# EAGLE design Teensy_FrequencyShield_2ch (EAGLE 6.5.0)
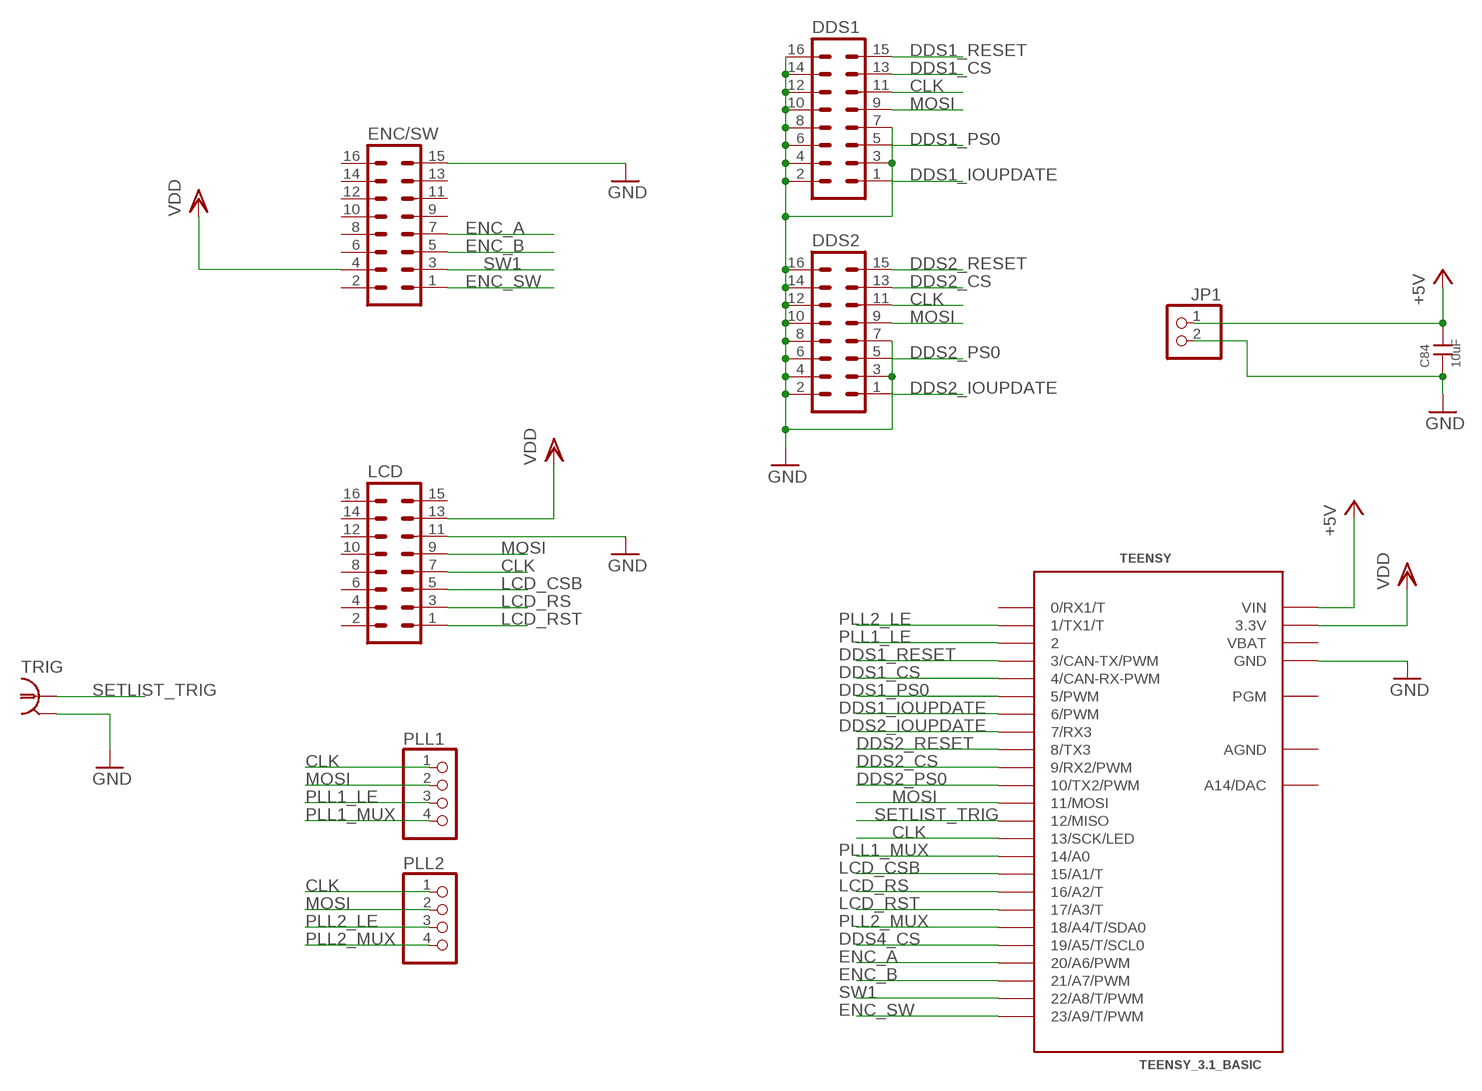
[diagram p0: schematic, sheet 1]

## Parts
C84  10uF  CAP0805  [0805]
DDS1  ML16  [ML16]
DDS2  ML16  [ML16]
ENC/SW  ML16  [ML16]
JP1  PINHD-1X2  [1X02]
LCD  ML16  [ML16]
PLL1  PINHD-1X4  [1X04]
PLL2  PINHD-1X4  [1X04]
TEENSY  TEENSY_3.1_BASIC  [TEENSY_3.1_BASIC]
TRIG  BNC-H  [BNC90]

## Nets
+5V: C84.2 JP1.1 TEENSY.VIN
CLK: DDS1.11 DDS2.11 LCD.7 PLL1.1 PLL2.1 TEENSY.13(13/SCK/LED)
DDS1_CS: DDS1.13 TEENSY.4(4/CAN-RX-PWM)
DDS1_IOUPDATE: DDS1.1 TEENSY.6(6/PWM)
DDS1_PS0: DDS1.5 TEENSY.5(5/PWM)
DDS1_RESET: DDS1.15 TEENSY.3(3/CAN-TX/PWM)
DDS2_CS: DDS2.13 TEENSY.9(9/RX2/PWM)
DDS2_IOUPDATE: DDS2.1 TEENSY.7(7/RX3)
DDS2_PS0: DDS2.5 TEENSY.10(10/TX2/PWM)
DDS2_RESET: DDS2.15 TEENSY.8(8/TX3)
DDS4_CS: TEENSY.19/A5(19/A5/T/SCL0)
ENC_A: ENC/SW.7 TEENSY.20/A6(20/A6/PWM)
ENC_B: ENC/SW.5 TEENSY.21/A7(21/A7/PWM)
ENC_SW: ENC/SW.1 TEENSY.23/A9(23/A9/T/PWM)
GND: C84.1 DDS1.2 DDS1.3 DDS1.4 DDS1.6 DDS1.7 DDS1.8 DDS1.10 DDS1.12 DDS1.14 DDS1.16 DDS2.2 DDS2.3 DDS2.4 DDS2.6 DDS2.7 DDS2.8 DDS2.10 DDS2.12 DDS2.14 DDS2.16 ENC/SW.15 JP1.2 LCD.11 TEENSY.GND TEENSY.GND1(GND) TRIG.2
LCD_CSB: LCD.5 TEENSY.15/A1(15/A1/T)
LCD_RS: LCD.3 TEENSY.16/A2(16/A2/T)
LCD_RST: LCD.1 TEENSY.17/A3(17/A3/T)
MOSI: DDS1.9 DDS2.9 LCD.9 PLL1.2 PLL2.2 TEENSY.11(11/MOSI)
PLL1_LE: PLL1.3 TEENSY.2
PLL1_MUX: PLL1.4 TEENSY.14/A0
PLL2_LE: PLL2.3 TEENSY.1(1/TX1/T)
PLL2_MUX: PLL2.4 TEENSY.18/A4(18/A4/T/SDA0)
SETLIST_TRIG: TEENSY.12(12/MISO) TRIG.1
SW1: ENC/SW.3 TEENSY.22/A8(22/A8/T/PWM)
VDD: ENC/SW.4 LCD.13 TEENSY.3.3V TEENSY.3.3V1(3.3V)
Unconnected: ENC/SW.2 ENC/SW.6 ENC/SW.8 ENC/SW.9 ENC/SW.10 ENC/SW.11 ENC/SW.12 ENC/SW.13 ENC/SW.14 ENC/SW.16 LCD.2 LCD.4 LCD.6 LCD.8 LCD.10 LCD.12 LCD.14 LCD.15 LCD.16 TEENSY.0(0/RX1/T) TEENSY.A14(A14/DAC) TEENSY.PGM

## Power pins joined to a net without a drawn wire
AGND: TEENSY.AGND
VBAT: TEENSY.VBAT

## Library data of the parts
C84 = rlc-jqi:CAP: SMT Capacitor; PARTNO: 1276-2890-1-ND
DDS1 DDS2 ENC/SW = mcu-accessories:ML16: HARTING 2x8 (16 pin) ribbon connector.; OC_FARNELL: unknown; OC_NEWARK: unknown
JP1 = pinhead:PINHD-1X2: PIN HEADER
LCD = mcu-accessories:ML16: HARTING 2x8 (16 pin) ribbon connector.; OC_FARNELL: unknown; OC_NEWARK: unknown; PARTNO: S9171-ND
PLL1 PLL2 = pinhead:PINHD-1X4: PIN HEADER
TEENSY = mcu-accessories:TEENSY_3.1_BASIC: Footprint for Teensy 3.1 board using all pin connections on the outer perimeter
TRIG = connector-jqi:BNC: BNC Connector.; DIGIKEY: 12345

## Board
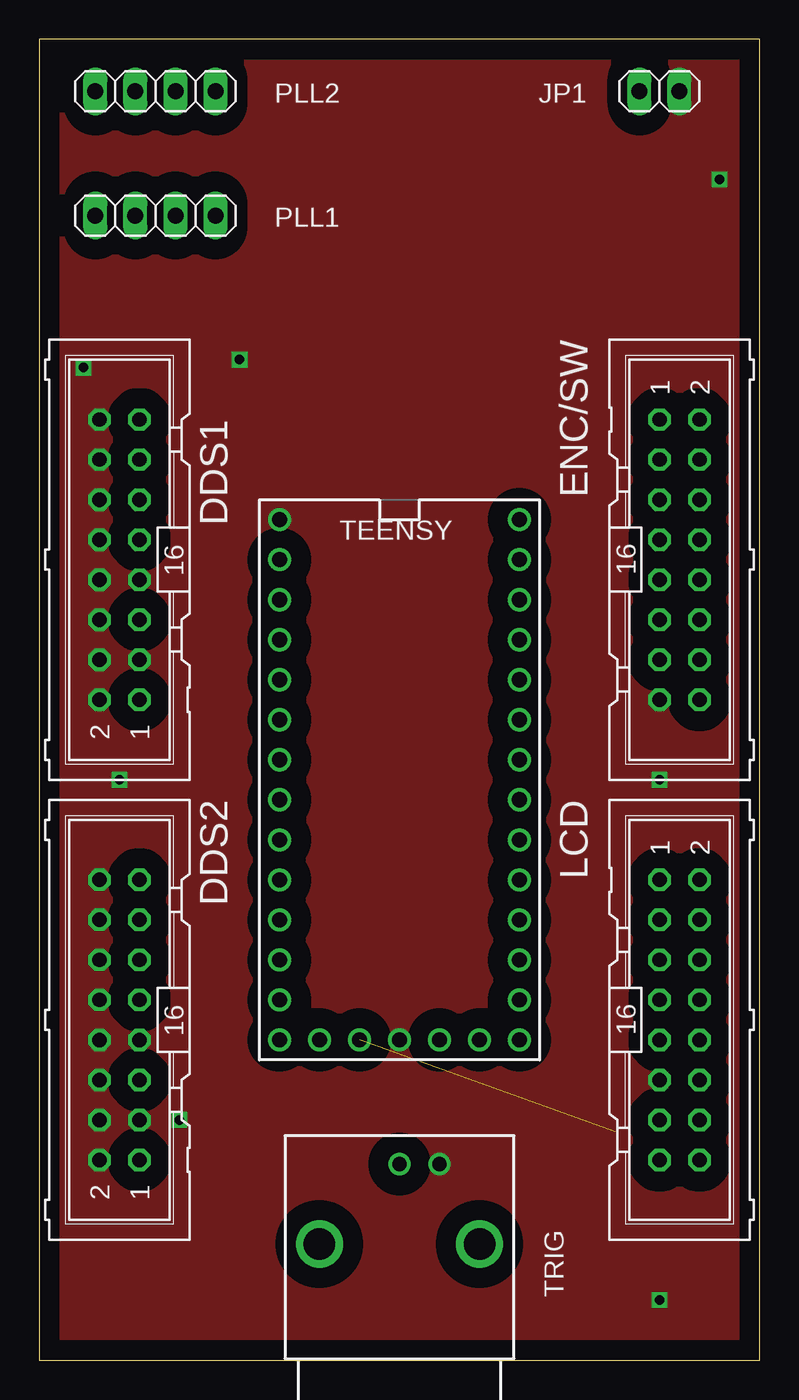
[diagram p1: board, top side]
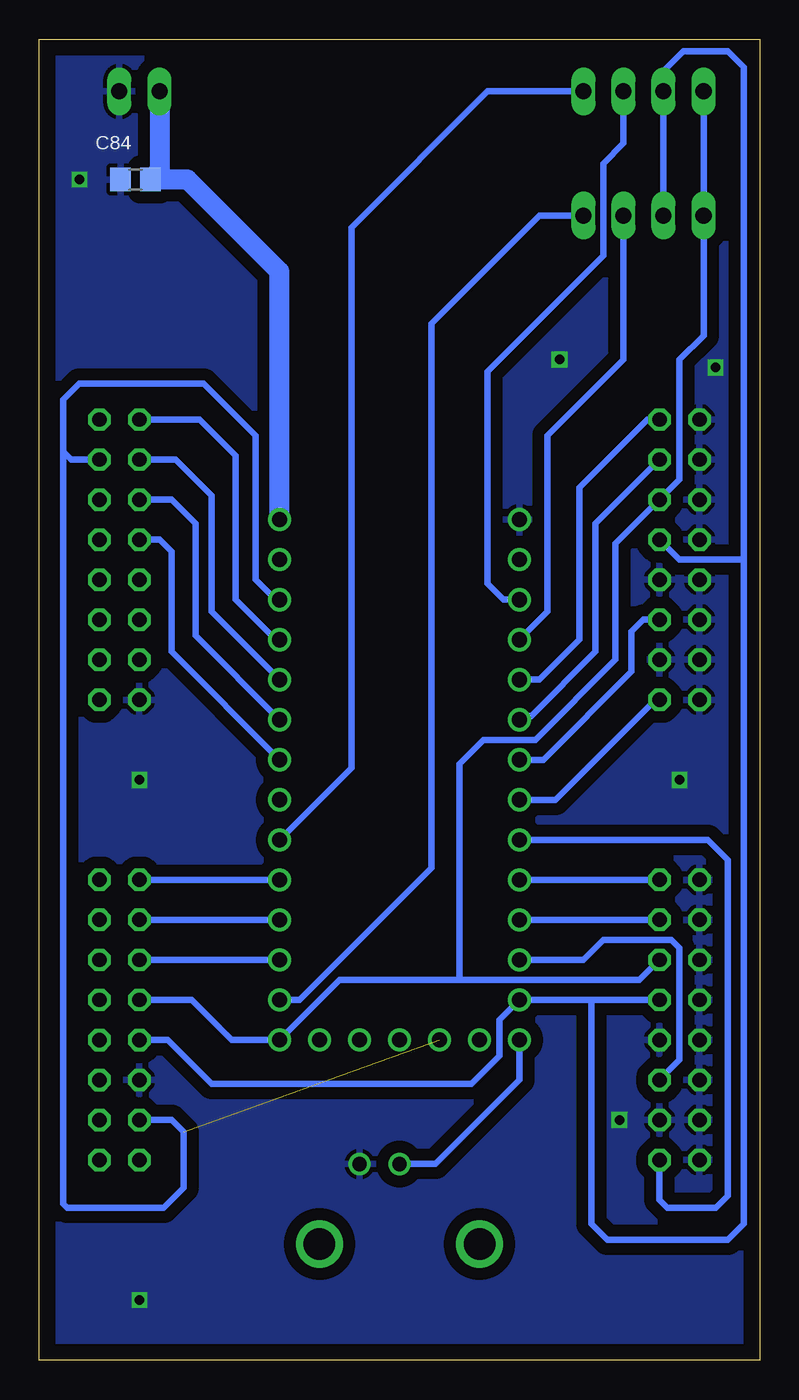
[diagram p2: board, bottom side, seen from below]

Size 45.72 x 83.82 mm. Coordinates in mm from the lower left corner, seen from the top.
Outline: 0,0 45.72,0 45.72,83.82 0,83.82 0,0
Copper layers (1*16): Top 0.035mm / dielectric 1.5mm / Bottom 0.035mm
Design rules "default": minimum track width 10mil, minimum drill 24mil, track to track 8mil, track to pad 8mil, pad to pad 8mil, via to via 8mil, smd to smd 8mil, copper to edge 40mil, drill to drill 8mil, minimum pad ring 10mil, minimum via ring 8mil, stop-mask expansion 4mil, vias tented up to drill 0mil, thermal gap 10mil

### Footprints (pad centres in the part's own frame; a part is rotated, then mirrored left to right if it is on the bottom)
0805 = smd 1.3 x 1.5: 1 -0.95,0; 2 0.95,0
ML16 = drill 0.914 octagon: 1 -8.89,-1.27; 2 -8.89,1.27; 3 -6.35,-1.27; 4 -6.35,1.27; 5 -3.81,-1.27; 6 -3.81,1.27; 7 -1.27,-1.27; 8 -1.27,1.27; 9 1.27,-1.27; 10 1.27,1.27; 11 3.81,-1.27; 12 3.81,1.27; 13 6.35,-1.27; 14 6.35,1.27; 15 8.89,-1.27; 16 8.89,1.27
1X02 = drill 1.016 long: 1 -1.27,0; 2 1.27,0
1X04 = drill 1.016 long: 1 -3.81,0; 2 -1.27,0; 3 1.27,0; 4 3.81,0
TEENSY_3.1_BASIC = drill 0.965: 0 -7.62,13.97; 1 -7.62,11.43; 2 -7.62,8.89; 3 -7.62,6.35; 3.3V 7.62,11.43; 3.3V1 -2.54,-16.51; 4 -7.62,3.81; 5 -7.62,1.27; 6 -7.62,-1.27; 7 -7.62,-3.81; 8 -7.62,-6.35; 9 -7.62,-8.89; 10 -7.62,-11.43; 11 -7.62,-13.97; 12 -7.62,-16.51; 13 7.62,-16.51; 14/A0 7.62,-13.97; 15/A1 7.62,-11.43; 16/A2 7.62,-8.89; 17/A3 7.62,-6.35; 18/A4 7.62,-3.81; 19/A5 7.62,-1.27; 20/A6 7.62,1.27; 21/A7 7.62,3.81; 22/A8 7.62,6.35; 23/A9 7.62,8.89; A14 5.08,-16.51; AGND 7.62,13.97; GND -7.62,16.51; GND1 0,-16.51; PGM 2.54,-16.51; VBAT -5.08,-16.51; VIN 7.62,16.51
BNC90 = drill 0.9 pad 1.27: 1 0,-5.08; 2 -2.54,-5.08 | drill 2 pad 2.032: ANCHOR1 -5.08,0; ANCHOR2 5.08,0

### Placement (x,y rotation side)
C84  39.62,74.93 0 bottom
DDS1  5.08,50.8 90 top
DDS2  5.08,21.59 90 top
ENC/SW  40.64,50.8 270 top
JP1  39.37,80.52 0 top
LCD  40.64,21.59 270 top
PLL1  7.37,72.64 0 top
PLL2  7.37,80.52 0 top
TEENSY  22.86,36.83 0 top
TRIG  22.86,7.37 180 top

### Tracks (layer width: path | path; a pad name or v marks a point on that pad's centre or on a via)
+5V
  Bottom 1.27: TEENSY.VIN 30.48,69.09 36.32,74.93 C84.2 38.1,75.5 JP1.1
CLK
  Bottom 0.406: LCD.7 36.07,22.86 33.53,20.32 TEENSY.13 26.67,24.13 19.05,24.13 | DDS2.11 7.62,24.13 19.05,24.13 | PLL2.1 PLL1.1 3.56,65.02 5.08,63.5 5.08,55.88 DDS1.11 9.14,51.82 9.14,44.45 14.22,39.37 17.53,39.37 19.05,37.85 19.05,24.13
DDS1_CS
  Bottom 0.406: DDS1.13 10.41,53.09 10.41,44.96 14.48,40.89 14.99,40.89 TEENSY.4
DDS1_IOUPDATE
  Bottom 0.406: DDS1.1 6.6,41.91 12.95,35.56 TEENSY.6
DDS1_PS0
  Bottom 0.406: TEENSY.5 13.72,38.1 8.13,43.69 8.13,46.23 7.37,46.99 DDS1.5
DDS1_RESET
  Bottom 0.406: TEENSY.3 13.97,43.18 11.43,45.72 11.43,55.37 7.11,59.69 DDS1.15
DDS2_CS
  Bottom 0.406: DDS2.13 TEENSY.9
DDS2_IOUPDATE
  Bottom 0.406: DDS2.1 6.35,10.16 5.84,9.65 2.79,9.65 2.03,10.41 2.03,31.75 3.3,33.02 TEENSY.7
DDS2_PS0
  Bottom 0.406: DDS2.5 5.08,19.05 5.08,26.16 5.59,26.67 9.91,26.67 11.18,25.4 TEENSY.10
DDS2_RESET
  Bottom 0.406: DDS2.15 TEENSY.8
ENC_A
  Bottom 0.406: TEENSY.20/A6 37.34,44.96 37.34,51.31 38.1,52.07 ENC/SW.7
ENC_B
  Bottom 0.406: TEENSY.21/A7 35.81,45.97 35.81,53.09 37.34,54.61 ENC/SW.5
ENC_SW
  Bottom 0.406: TEENSY.23/A9 30.73,45.72 33.27,48.26 33.27,57.4 35.56,59.69 ENC/SW.1
GND  (via drill 0.6)
  other vias: 12.7,63.5 5.08,36.83 43.18,74.93 39.37,36.83 39.37,3.81 8.89,15.24 2.79,62.99
  pour Bottom (isolate 0.762): 0,83.82 45.72,83.82 45.72,0 0,0
  pour Top (isolate 1.27, no thermals): 0,83.82 45.72,83.82 45.72,0 0,0
LCD_CSB
  Bottom 0.406: LCD.5 TEENSY.15/A1
LCD_RS
  Bottom 0.406: LCD.3 TEENSY.16/A2
LCD_RST
  Bottom 0.406: TEENSY.17/A3 LCD.1
MOSI
  Bottom 0.406: 10.67,22.86 TEENSY.11 16.51,21.59 16.51,19.3 18.29,17.53 34.8,17.53 37.59,20.32 LCD.9 | PLL1.2 PLL2.2 6.1,81.79 4.83,83.06 2.03,83.06 1.02,82.04 1.02,50.8 | DDS2.9 10.67,22.86 | 10.67,22.86 10.67,8.64 9.65,7.62 2.03,7.62 1.02,8.64 1.02,50.8 | DDS1.9 5.08,50.8 1.02,50.8
N$1
  cutout Bottom: 16.26,24.38 27.94,24.38 27.94,17.53 16.26,17.53
PLL1_LE
  Bottom 0.406: TEENSY.2 13.46,47.5 13.46,58.67 8.64,63.5 PLL1.3
PLL1_MUX
  Bottom 0.406: PLL1.4 13.97,72.64 20.83,65.79 20.83,31.24 29.21,22.86 TEENSY.14/A0
PLL2_LE
  Bottom 0.406: TEENSY.1 16.26,48.26 17.27,49.28 17.27,62.74 9.91,70.1 9.91,75.95 8.64,77.22 PLL2.3
PLL2_MUX
  Bottom 0.406: PLL2.4 17.27,80.52 25.91,71.88 25.91,37.59 TEENSY.18/A4
SETLIST_TRIG
  Bottom 0.406: TEENSY.12 15.24,17.78 20.57,12.45 TRIG.1
SW1
  Bottom 0.406: TEENSY.22/A8 34.8,47.5 34.8,54.86 37.08,57.15 ENC/SW.3
VDD  (1 unrouted)
  Bottom 0.406: TEENSY.3.3V 30.73,48.26 32,49.53 32,58.67 35.31,61.98 43.18,61.98 44.2,60.96 44.2,57.66 | 44.2,57.66 43.69,57.15 ENC/SW.4 | LCD.13 37.34,15.24 36.58,14.48 36.58,10.92 37.85,9.65 43.94,9.65 44.2,9.91 44.2,57.66